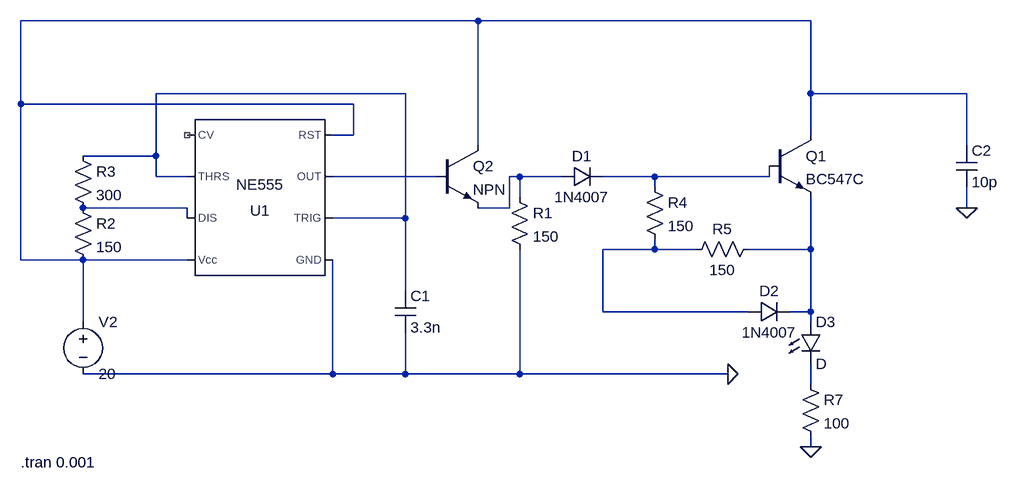
[diagram p0: schematic fast pulser scheme_with extra bjt layer.asc]
fast pulser scheme_with extra bjt layer.asc, the LTspice schematic file:
Version 4
SHEET 1 880 680
WIRE 48 -144 -656 -144
WIRE 560 -144 48 -144
WIRE -64 -32 -448 -32
WIRE 560 -32 560 -144
WIRE 800 -32 560 -32
WIRE -656 -16 -656 -144
WIRE -144 -16 -656 -16
WIRE -144 32 -144 -16
WIRE -144 32 -176 32
WIRE 560 32 560 -32
WIRE 48 48 48 -144
WIRE 800 48 800 -32
WIRE -448 64 -448 -32
WIRE -448 64 -560 64
WIRE -448 96 -448 64
WIRE -400 96 -448 96
WIRE -16 96 -176 96
WIRE 112 96 96 96
WIRE 176 96 112 96
WIRE 320 96 240 96
WIRE 496 96 496 80
WIRE 496 96 320 96
WIRE 320 112 320 96
WIRE 112 128 112 96
WIRE -400 144 -560 144
WIRE 96 144 96 96
WIRE 96 144 48 144
WIRE 800 144 800 112
WIRE -400 160 -400 144
WIRE -64 160 -64 -32
WIRE -64 160 -176 160
WIRE 320 208 320 192
WIRE 320 208 240 208
WIRE 384 208 320 208
WIRE 560 208 560 128
WIRE 560 208 464 208
WIRE -656 224 -656 -16
WIRE -560 224 -656 224
WIRE -400 224 -560 224
WIRE -64 272 -64 160
WIRE 240 304 240 208
WIRE 464 304 240 304
WIRE 560 304 560 208
WIRE 560 304 528 304
WIRE -560 320 -560 224
WIRE 560 320 560 304
WIRE -176 400 -176 224
WIRE -176 400 -560 400
WIRE -64 400 -64 336
WIRE -64 400 -176 400
WIRE 112 400 112 208
WIRE 112 400 -64 400
WIRE 432 400 112 400
WIRE 560 416 560 384
WIRE 560 512 560 496
FLAG 432 400 0
FLAG 560 512 0
FLAG 800 144 0
SYMBOL Misc\\NE555 -288 128 R180
SYMATTR InstName U1
SYMBOL voltage -560 304 R0
WINDOW 123 0 0 Left 0
WINDOW 39 0 0 Left 0
SYMATTR InstName V2
SYMATTR Value 20
SYMBOL res -576 128 R0
SYMATTR InstName R2
SYMATTR Value 150
SYMBOL res -576 48 R0
SYMATTR InstName R3
SYMATTR Value 300
SYMBOL cap -80 272 R0
SYMATTR InstName C1
SYMATTR Value 3.3n
SYMBOL diode 176 112 R270
WINDOW 0 32 32 VTop 2
WINDOW 3 0 32 VBottom 2
SYMATTR InstName D1
SYMATTR Value 1N4007
SYMBOL res 96 112 R0
SYMATTR InstName R1
SYMATTR Value 150
SYMBOL res 304 96 R0
SYMATTR InstName R4
SYMATTR Value 150
SYMBOL res 480 192 R90
WINDOW 0 0 56 VBottom 2
WINDOW 3 32 56 VTop 2
SYMATTR InstName R5
SYMATTR Value 150
SYMBOL npn 496 32 R0
SYMATTR InstName Q1
SYMATTR Value BC547C
SYMBOL LED 544 320 R0
SYMATTR InstName D3
SYMBOL res 544 400 R0
SYMATTR InstName R7
SYMATTR Value 100
SYMBOL cap 784 48 R0
SYMATTR InstName C2
SYMATTR Value 10p
SYMBOL diode 464 320 R270
WINDOW 0 32 32 VTop 2
WINDOW 3 0 32 VBottom 2
SYMATTR InstName D2
SYMATTR Value 1N4007
SYMBOL npn -16 48 R0
SYMATTR InstName Q2
TEXT -656 536 Left 2 !.tran 0.001

The netlist it stands for:
* fast pulser scheme_with extra bjt layer.asc
XU1 0 N002 N003 N001 NC_01 N002 N006 N001 NE555  ; pins GND TRIG OUT RST CV THRS DIS Vcc
V2 N001 0 20
R2 N006 N001 150
R3 N002 N006 300
C1 N002 0 3.3n
D1 N004 N005 1N4007
R1 N004 0 150
R4 N005 N007 150
R5 N008 N007 150
Q1 N001 N005 N008 0 BC547C
D3 N008 N009 D
R7 N009 0 100
C2 N001 0 10p
D2 N007 N008 1N4007
Q2 N001 N003 N004 0 NPN
.model D D
.lib standard.dio
.model NPN NPN
.model PNP PNP
.lib standard.bjt
.tran 0.001
.lib NE555.sub
.backanno
.end